# EAGLE design Serial_Gauge_V0.1 (EAGLE 9.4.2)
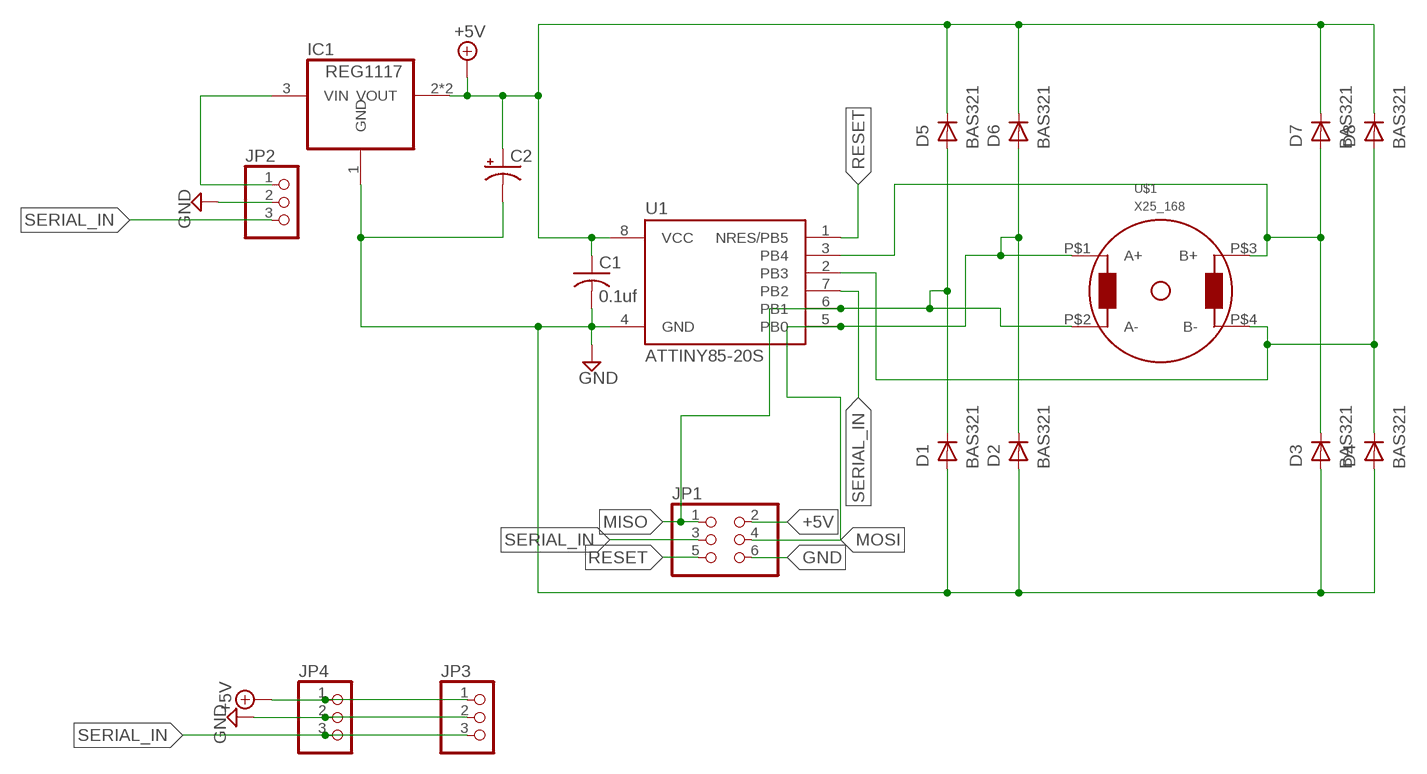
[diagram p0: schematic, sheet 1]

## Parts
C1  0.1uf  C-USC1206K  [C1206K]
C2  CPOL-US140CLH-0810  [140CLH-0810]
D1  BAS321  [SOD323(F)]
D2  BAS321  [SOD323(F)]
D3  BAS321  [SOD323(F)]
D4  BAS321  [SOD323(F)]
D5  BAS321  [SOD323(F)]
D6  BAS321  [SOD323(F)]
D7  BAS321  [SOD323(F)]
D8  BAS321  [SOD323(F)]
IC1  REG1117  [SOT223]
JP1  PINHD-2X3  [2X03]
JP2  PINHD-1X3  [1X03]
JP3  PINHD-1X3  [1X03]
JP4  PINHD-1X3  [1X03]
U1  ATTINY85-20S  [SOIC8_EIAJ_208MIL]
U$1  X25_168  [X25_168]

## Nets
+5V: C1.1 C2.+ D5.1(K) D6.1(K) D7.1(K) D8.1(K) IC1.2(VOUT) IC1.4(VOUT) JP1.2 JP3.1 JP4.1 U1.8(VCC)
GND: C1.2 C2.- D1.2(A) D2.2(A) D3.2(A) D4.2(A) IC1.1(GND) JP1.6 JP2.2 JP3.2 JP4.2 U1.4(GND)
MISO: D1.1(K) D5.2(A) JP1.1 U1.6(PB1) U$1.P$2(A-)
MOSI: D2.1(K) D6.2(A) JP1.4 U1.5(PB0) U$1.P$1(A+)
N$1: IC1.3(VIN) JP2.1
N$9: D4.1(K) D8.2(A) U1.2(PB3) U$1.P$4(B-)
N$10: D3.1(K) D7.2(A) U1.3(PB4) U$1.P$3(B+)
RESET: JP1.5 U1.1(NRES/PB5)
SERIAL_IN: JP1.3 JP2.3 JP3.3 JP4.3 U1.7(PB2)

## Library data of the parts
C1 = rcl:C-US: CAPACITOR, American symbol; SPICEPREFIX: C
C2 = rcl:CPOL-US: POLARIZED CAPACITOR, American symbol; SPICEPREFIX: C
D1-D8 = nxp_60_1_1:BAS321: General purpose diode The BAS321 is a general purpose diode fabricated in planar technology and encapsulated in a plastic SOD323 package. AAL Eindhoven MK
IC1 = regulator 1117:REG1117: 800mA and 1A Low Dropout (LDO) Positive Regulator 1.8V, 2.5V, 2.85V, 3.3V, 5V, and Adj; MPN: REG1117; OC_FARNELL: 1097566; OC_NEWARK: 14P6981
JP1 = pinhead:PINHD-2X3: PIN HEADER
JP2-JP4 = pinhead:PINHD-1X3: PIN HEADER
U1 = attiny25_45_85:ATTINY85*: ATMEL ATtiny 85 Packages: P = PDIP 08 30mil S = SOIC 08 EIAJ 208mil Technologies Note: for complete ordering code (temp. range, finish, tape&reel etc.) see www.atmel.com • Supply Voltage: V = (1.8…5.5)V | [blank] = (2.7…5.5)V • Speed: 10 = 10 MHz | 20 = 20 MHz Author: Dipl.-Ing. FH Rainer Bayer HHN Hochschule Heilbronn (Heilbronn University), rainer.bayer@hs-heilbronn.de Ingenieurbüro ing-rb, mail@ing-rb.de
U$1 = x25_168:X25_168: X25168 - Miniature stepper motor for analog gauge

## Board
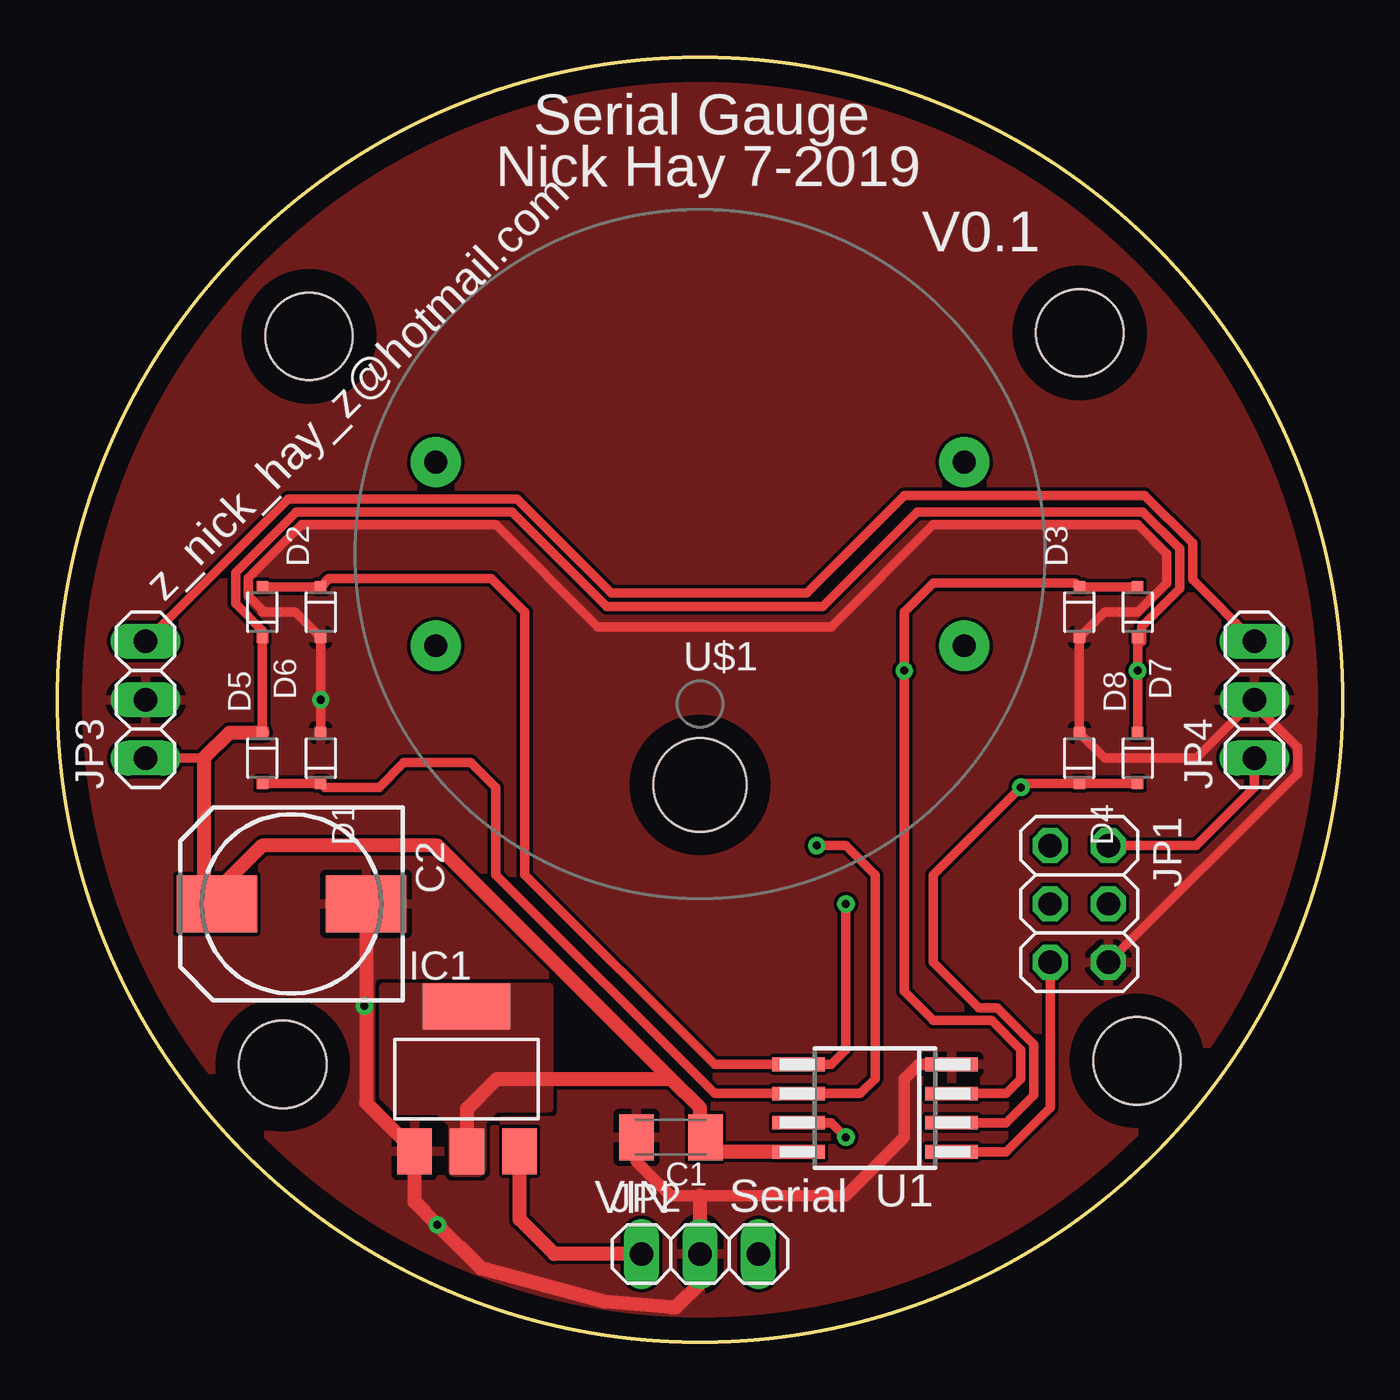
[diagram p1: board, top side]
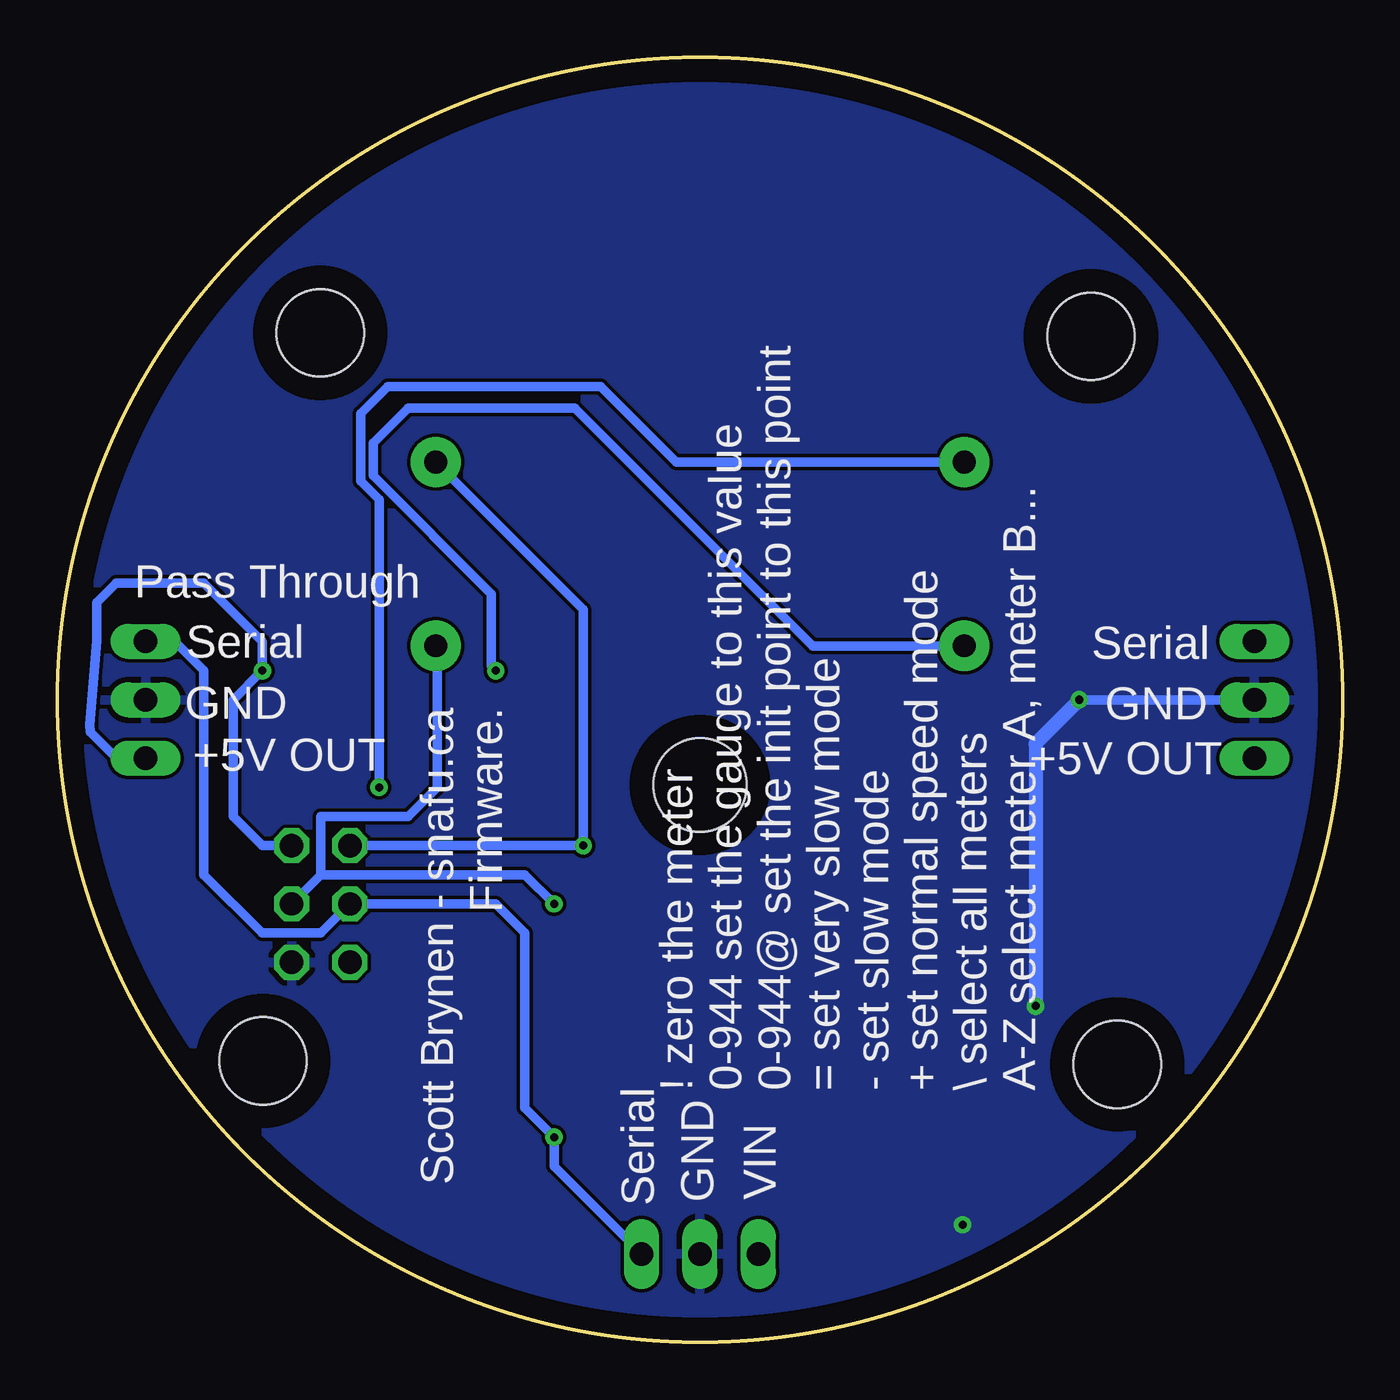
[diagram p2: board, bottom side, seen from below]

Size 55.94 x 55.94 mm. Coordinates in mm from the lower left corner, seen from the top.
Outline: circle at 27.97,27.97 radius 27.97
Copper layers (1*16): Top 0.035mm / dielectric 1.5mm / Bottom 0.035mm
Design rules "default": minimum track width 6mil, minimum drill 0.35mm, track to track 6mil, track to pad 6mil, pad to pad 6mil, via to via 6mil, smd to smd 6mil, copper to edge 40mil, drill to drill 6mil, minimum pad ring 10mil, minimum via ring 8mil, stop-mask expansion 4mil, vias tented up to drill 0mil, thermal gap 10mil
Holes 4.06 mm at 27.97,24.26
Holes 3.81 mm at 44.5,43.95 46.99,12.25 10.95,43.79 9.81,12.09

### Footprints (pad centres in the part's own frame; a part is rotated, then mirrored left to right if it is on the bottom)
C1206K = smd 1.5 x 2: 1 -1.5,0; 2 1.5,0
140CLH-0810 = smd 3.5 x 2.5: + 3.25,0; - -3.25,0
SOD323(F) = smd 0.5 x 0.5: 1 1.1,0; 2 -1.1,0
SOT223 = smd 1.499 x 2.007: 1 -2.261,-3.15; 2 0.025,-3.15; 3 2.311,-3.15 | smd 3.81 x 2.007: 4 0,3.15
2X03 = drill 1.016 octagon: 1 -2.54,-1.27; 2 -2.54,1.27; 3 0,-1.27; 4 0,1.27; 5 2.54,-1.27; 6 2.54,1.27
1X03 = drill 1.016 long: 1 -2.54,0; 2 0,0; 3 2.54,0
SOIC8_EIAJ_208MIL = smd 0.6 x 2.286: 1 -1.905,-3.33; 2 -0.635,-3.33; 3 0.635,-3.33; 4 1.905,-3.33; 5 1.905,3.33; 6 0.635,3.33; 7 -0.635,3.33; 8 -1.905,3.33
X25_168 = drill 1 pad 2.184: P$1 -11.5,4; P$2 -11.5,-4; P$3 11.5,4; P$4 11.5,-4

### Placement (x,y rotation side)
C1  26.7,8.92 180 top
C2  10.19,19.08 180 top
D1  11.46,25.43 270 top
D2  11.46,31.78 90 top
D3  44.48,31.78 90 top
D4  44.48,25.43 270 top
D5  8.92,25.43 90 top
D6  8.92,31.78 270 top
D7  47.02,31.78 270 top
D8  47.02,25.43 90 top
IC1  17.81,11.46 0 top
JP1  44.48,19.08 270 top
JP2  27.97,3.84 0 top
JP3  3.84,27.97 90 top
JP4  52.1,27.97 90 top
U1  35.59,10.19 90 top
U$1  27.97,34.32 180 top

### Tracks (layer width: path | path; a pad name or v marks a point on that pad's centre or on a via)
+5V  (via drill 0.35)
  Top 0.406: D5.1 D6.1 8.92,30.99 7.75,32.15 7.75,33.51 10.39,36.15 19.79,36.15 23.9,32.03 33.3,32.03 37.42,36.15 47.25,36.15 48.85,34.55 48.85,32.82 47.19,31.16 47.19,30.51 D7.1 v47.02,29.24 D8.1 | JP3.1 6.38,25.43 | JP1.2 49.56,21.62 52.1,24.16 JP4.1
  Top 0.61: IC1.2 17.83,10.16 19.13,11.46 26.7,11.46 | 26.7,11.46 27.97,10.19 27.97,9.15 C1.1 28.83,8.28 U1.8 | 26.7,11.46 16.54,21.62 8.92,21.62 6.94,19.64 C2.+ 6.38,19.64 6.38,25.43 7.48,26.53 D5.1
  Bottom 0.406: JP1.2 47.02,21.62 48.29,22.89 48.29,27.97 v47.02,29.24 47.02,30.51 49.56,33.05 53.37,33.05 54.22,32.2 54.22,30.54 54.54,26.87 54.51,26.57 53.37,25.43 JP4.1
  pour Top (no thermals): 14.2,15.45 21.39,15.45 21.39,10.19 19.08,10.19 18.47,9.58 18.47,7.52 18.34,7.39 17.28,7.39 17.2,7.47 17.2,9.48 16.59,10.09 14.79,10.09 14.2,10.67
GND  (via drill 0.35)
  Top 0.406: D1.2 v11.46,27.97 D2.2 10.36,31.78 8.92,31.78 8.92,31.88 8.31,32.48 8.31,33.28 10.63,35.59 19.08,35.59 23.52,31.14 33.68,31.14 38.13,35.59 47.02,35.59 48.29,34.32 48.29,33.05 47.02,31.78 45.58,31.78 D3.2 D4.2 45.58,25.43 49.56,25.43 JP4.2 52.1,27.77 53.98,25.89 53.98,24.77 JP1.6
  Top 0.508: U1.4 37.49,12.09 36.86,11.46 36.86,8.92 34.32,6.38 27.97,6.38 26.7,6.38 25.2,7.88 C1.2
  Top 0.61: 27.97,6.38 JP2.2 27.97,2.57 26.91,1.51 26.72,1.51 23.83,1.76 18.44,3.2 v16.54,5.11 15.55,6.1 IC1.1 13.44,10.42 13.44,14.56 | C2.- 13.44,14.56 | v13.36,14.63 13.44,14.56
  Bottom 0.406: JP3.2 v11.46,27.97
  Bottom 0.61: v11.46,27.97 13.36,26.06 v13.36,14.63
  pour Top (rank 2): 6.61,46.87 -0.38,39.88 -0.38,36.2 -0.63,35.94 -0.63,18.7 -0.63,14.68 4.96,9.1 14.86,-0.81 27.79,-0.81 40.01,-0.81 50.85,10.04 56.62,15.8 56.62,37.27 56.62,39.93 41.66,54.89 39.83,56.72 20.68,56.72 16.34,56.72 6.61,46.99
  pour Bottom: -0.56,28.43 -0.56,14.56 14.68,-0.68 40.54,-0.68 40.82,-0.4 56.54,15.32 56.54,17.71 56.54,39.7 56.54,39.93 40.11,56.37 16.41,56.37 16.28,56.24 -0.5,39.45 -0.5,28.38
MISO  (via drill 0.35)
  Top 0.406: D5.2 D1.1 11.63,24.16 14,24.16 15.08,25.24 18,25.24 19.08,24.16 19.08,20.35 28.6,10.82 U1.6 34.95,10.82 35.59,11.46 35.59,20.35 34.32,21.62 v33.05,21.62
  Bottom 0.406: JP1.1 v33.05,21.62 33.05,31.9 U$1.P$2
MOSI  (via drill 0.35)
  Top 0.406: D6.2 D2.1 11.82,33.24 18.89,33.24 20.35,31.78 20.35,20.35 28.6,12.09 U1.5 33.68,12.09 34.32,12.73 v34.32,19.08
  Bottom 0.406: v34.32,19.08 35.59,20.35 44.48,20.35 | JP1.4 44.48,20.35 | 44.48,20.35 44.48,22.89 40.67,22.89 39.4,24.16 39.4,30.25 U$1.P$1
N$1
  Top 0.61: IC1.3 20.12,5.34 21.62,3.84 JP2.1
N$9  (via drill 0.35)
  Top 0.406: D8.2 D4.1 42.11,24.33 v41.94,24.16 38.13,20.35 38.13,16.54 40.11,14.56 40.9,14.56 42.5,12.96 42.5,10.75 41.3,9.55 U1.2
  Bottom 0.406: U$1.P$4 29.01,38.32 32.29,41.6 41.57,41.6 42.75,40.42 42.75,37.49 41.94,36.68 v41.94,24.16
N$10  (via drill 0.35)
  Top 0.406: D7.2 D3.1 44.31,33.05 38.13,33.05 36.86,31.78 v36.86,29.24 36.86,15.27 38.13,14 40.67,14 41.94,12.73 41.94,11.46 41.3,10.82 U1.3
  Bottom 0.406: U$1.P$3 23.07,30.32 33.42,40.67 40.67,40.67 42.19,39.15 42.19,37.72 37.05,32.58 37.05,29.43 v36.86,29.24
RESET
  Top 0.406: JP1.5 43.21,10.19 41.3,8.28 U1.1
SERIAL_IN  (via drill 0.35)
  Top 0.406: JP3.3 10.04,36.71 20.02,36.71 24.11,32.62 32.62,32.62 36.86,36.86 47.33,36.86 49.41,34.78 49.41,33.2 JP4.3 | U1.7 33.68,9.55 v34.32,8.92
  Bottom 0.406: JP2.3 34.32,7.65 v34.32,8.92 35.59,10.19 35.59,17.81 36.86,19.08 JP1.3 44.48,17.81 47.02,17.81 49.56,20.35 49.56,29.24 50.83,30.51 JP4.3

### Text on the board
_tsilk: Serial Gauge | Nick Hay 7-2019 | V0.1 | z_nick_hay_z@hotmail.com | VIN | Serial
_bsilk: Pass Through | Serial | Serial | GND | GND | Scott Brynen - snafu.ca / Firmware. | +5V OUT | +5V OUT | Serial | ! zero the meter / 0-944 set the gauge to this value / 0-944@ set the init point to this point / = set very slow mode / - set slow mode / + set normal speed mode / \ select all meters / A-Z select meter A, meter B... | GND | VIN